# Altium project 高压小功率FOC驱动板.PrjPcb
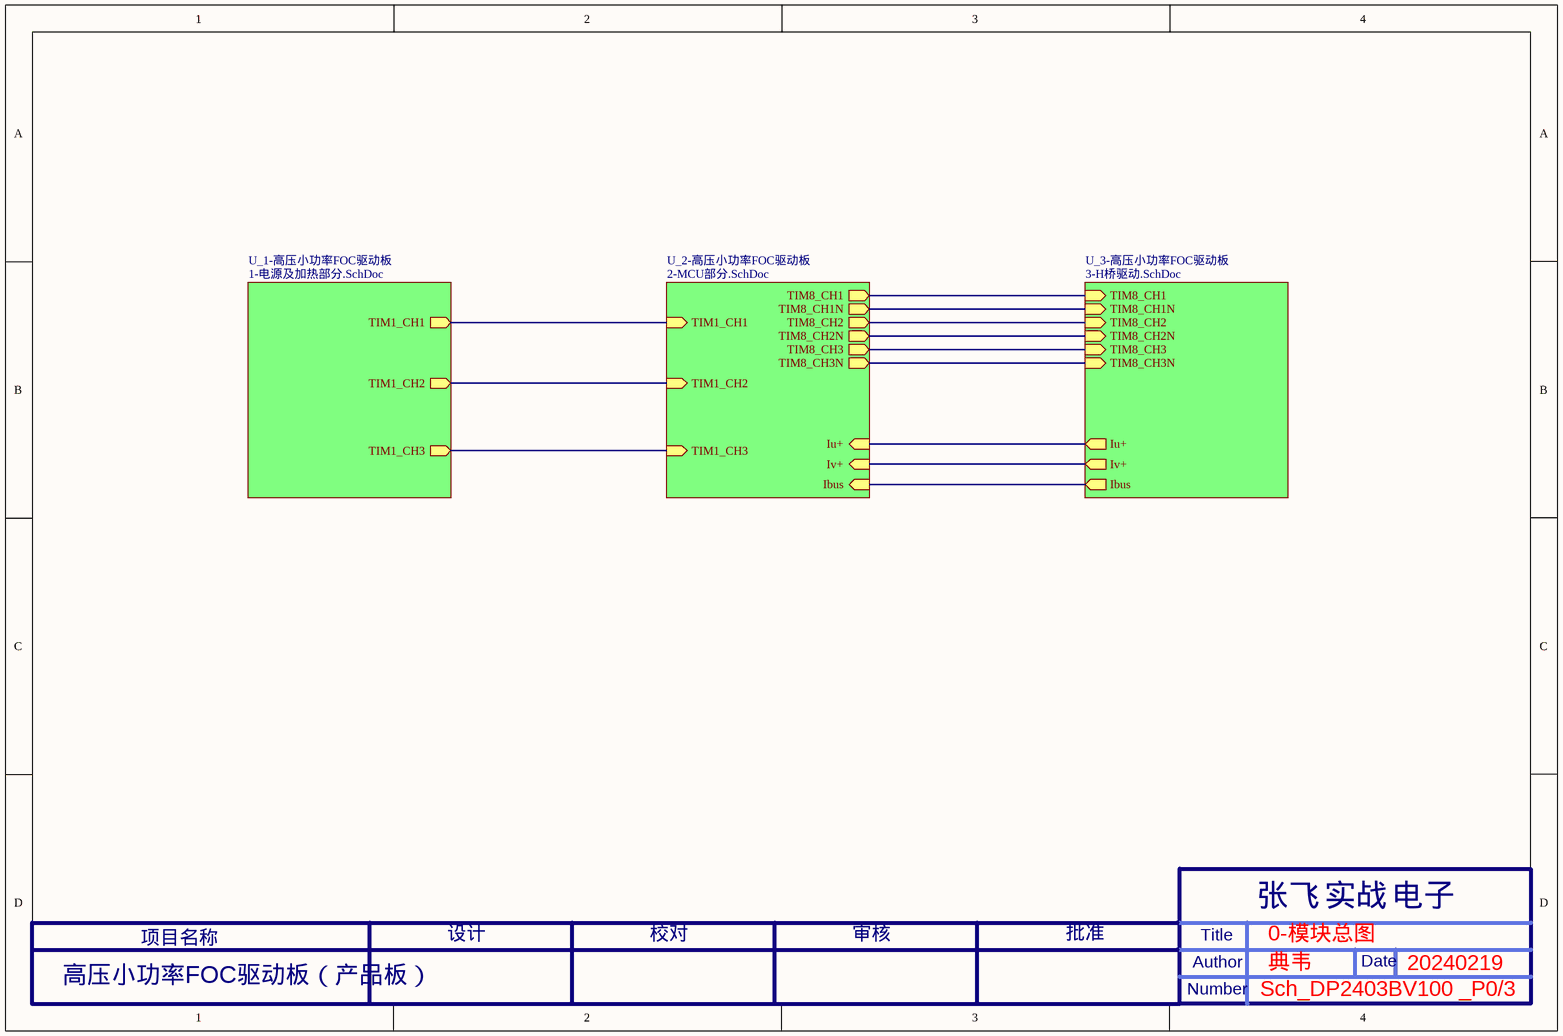
[diagram p0: 0-模块总图.SchDoc]
3 sheets, 103 parts. Net scope: hierarchical (ports join the sheet entries above them; power ports are global).
Board file: 高压小功率FOC驱动板.PcbDoc
Sheets:
  0-模块总图.SchDoc
    U_1-高压小功率FOC驱动板 = 1-电源及加热部分.SchDoc
    U_3-高压小功率FOC驱动板 = 3-H桥驱动.SchDoc

## Sheet 0-模块总图.SchDoc
size A4; SheetNumber: 1; SheetTotal: 4

### Sub-sheets
U_1-高压小功率FOC驱动板 = 1-电源及加热部分.SchDoc: TIM1_CH2 (out), TIM1_CH3 (out), TIM1_CH1 (out)
U_2-高压小功率FOC驱动板 = 2-MCU部分.SchDoc (file not in this document): TIM1_CH2 (in), TIM1_CH3 (in), TIM1_CH1 (in), TIM8_CH1 (out), TIM8_CH1N (out), TIM8_CH2 (out), TIM8_CH2N (out), TIM8_CH3 (out), TIM8_CH3N (out), Ibus (in), Iu+ (in), Iv+ (in)
U_3-高压小功率FOC驱动板 = 3-H桥驱动.SchDoc: TIM8_CH1 (in), TIM8_CH1N (in), TIM8_CH2 (in), TIM8_CH2N (in), TIM8_CH3 (in), TIM8_CH3N (in), Iu+ (out), Iv+ (out), Ibus (out)

### Nets
Ibus: sheet U_2-高压小功率FOC驱动板/Ibus, sheet U_3-高压小功率FOC驱动板/Ibus
TIM1_CH1: sheet U_1-高压小功率FOC驱动板/TIM1_CH1, sheet U_2-高压小功率FOC驱动板/TIM1_CH1
TIM1_CH2: sheet U_1-高压小功率FOC驱动板/TIM1_CH2, sheet U_2-高压小功率FOC驱动板/TIM1_CH2
TIM1_CH3: sheet U_1-高压小功率FOC驱动板/TIM1_CH3, sheet U_2-高压小功率FOC驱动板/TIM1_CH3
TIM8_CH1: sheet U_2-高压小功率FOC驱动板/TIM8_CH1, sheet U_3-高压小功率FOC驱动板/TIM8_CH1
TIM8_CH1N: sheet U_2-高压小功率FOC驱动板/TIM8_CH1N, sheet U_3-高压小功率FOC驱动板/TIM8_CH1N
TIM8_CH2: sheet U_2-高压小功率FOC驱动板/TIM8_CH2, sheet U_3-高压小功率FOC驱动板/TIM8_CH2
TIM8_CH2N: sheet U_2-高压小功率FOC驱动板/TIM8_CH2N, sheet U_3-高压小功率FOC驱动板/TIM8_CH2N
TIM8_CH3: sheet U_2-高压小功率FOC驱动板/TIM8_CH3, sheet U_3-高压小功率FOC驱动板/TIM8_CH3
TIM8_CH3N: sheet U_2-高压小功率FOC驱动板/TIM8_CH3N, sheet U_3-高压小功率FOC驱动板/TIM8_CH3N
NetQ6_S: sheet U_2-高压小功率FOC驱动板/Iu+, sheet U_3-高压小功率FOC驱动板/Iu+
NetQ8_S: sheet U_2-高压小功率FOC驱动板/Iv+, sheet U_3-高压小功率FOC驱动板/Iv+

### Notes on the sheet
- 高压小功率FOC驱动板（产品板）
- 典韦
- 0-模块总图
- 20240219
- Sch_DP2403BV100 _P0/3
- 张飞
- 实战
- 电子
- 项目名称
- 设计
- 校对
- 审核
- 批准
- Author
- Title
- Date
- Number

## Sheet 1-电源及加热部分.SchDoc
size A4; SheetNumber: 2; SheetTotal: 4
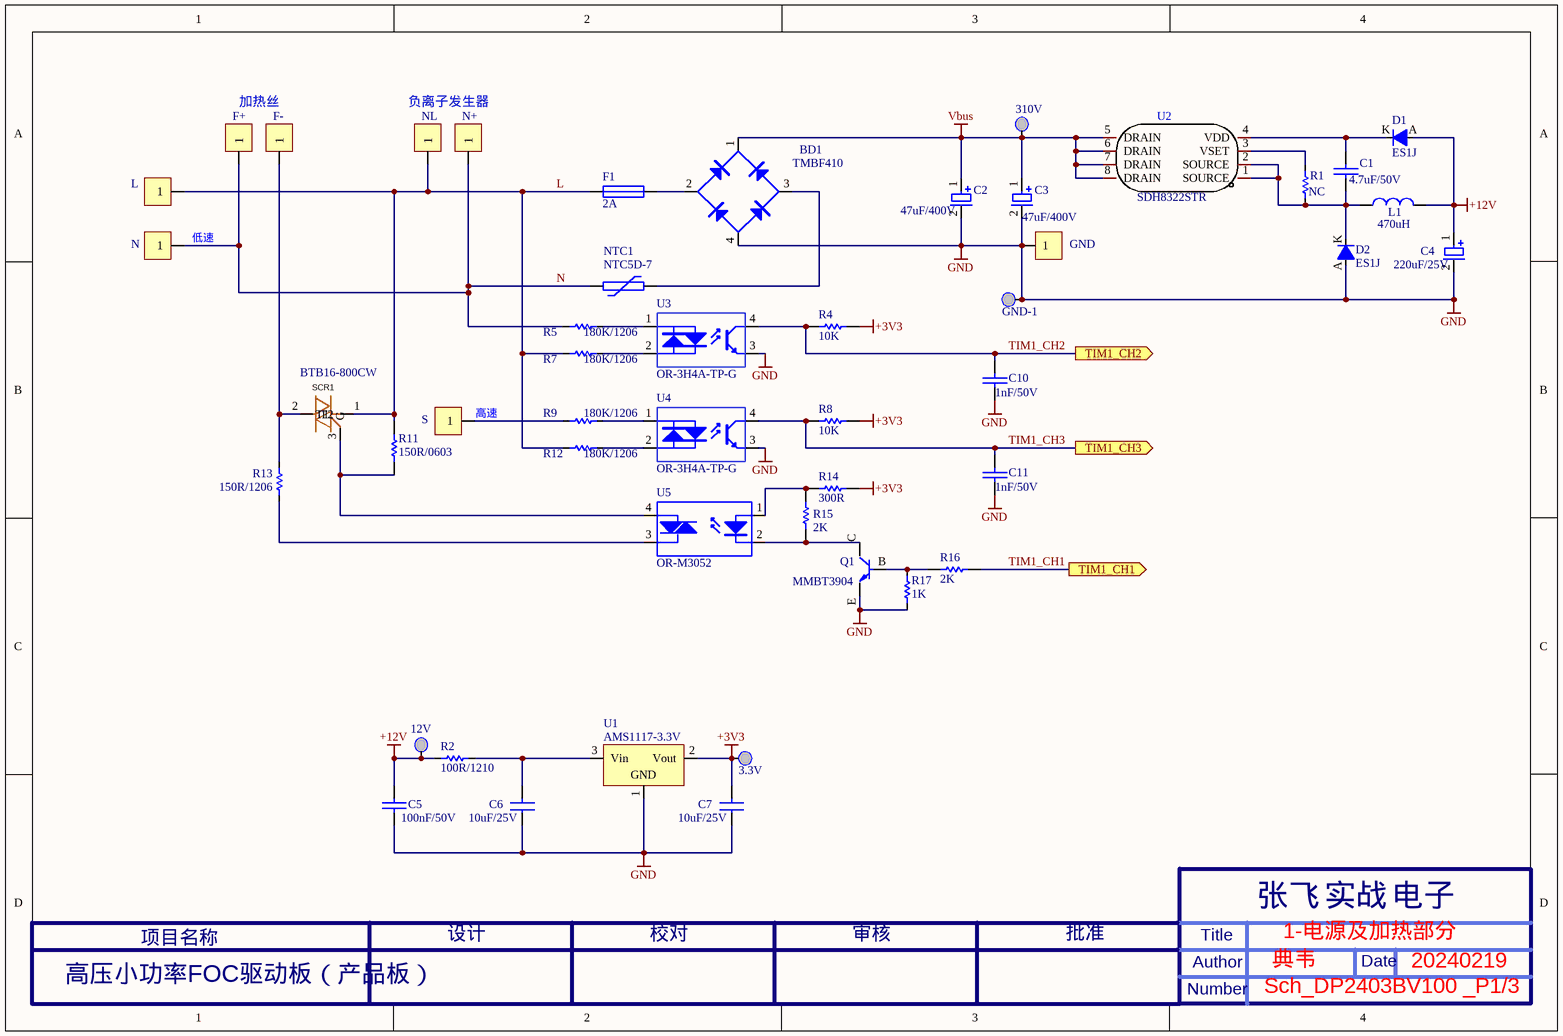
[diagram p1: 1-电源及加热部分.SchDoc]

### Parts
3.3V  test point  [Test_Port]  (value not drawn)  (no BOM)
12V  test point  [Test_Port]  (value not drawn)  (no BOM)
310V  test point  [Test_Port]  (value not drawn)  (no BOM)
BD1  TMBF410  [DBF]
C1  4.7uF/50V  [C0805]
C2  47uF/400V  [D13/L21-5]
C3  47uF/400V  [D13/L21-5]
C4  220uF/25V  [RB3.5/8.2]
C5  100nF/50V  [C0603]
C6  10uF/25V  [C0805]
C7  10uF/25V  [C0805]
C10  1nF/50V  [C0603]
C11  1nF/50V  [C0603]
D1  ES1J  [DO-214AC(SMA)]
D2  ES1J  [DO-214AC(SMA)]
F1  2A  [JFC2410-1200FS]
F+  LT  [IGBT-PIN]  (value not drawn)
F-  T1  [IGBT-PIN]  (value not drawn)
GND  GND  [IGBT-PIN]  (value not drawn)
GND-1  test point  [Test_Port]  (value not drawn)  (no BOM)
L  L  [IGBT-PIN]  (value not drawn)
L1  470uH  [L4.4/7]
N  SL  [IGBT-PIN]  (value not drawn)
N+  NA  [IGBT-PIN]  (value not drawn)
NL  LA  [IGBT-PIN]  (value not drawn)
NTC1  NTC5D-7  [NTC-5D9]
Q1  MMBT3904  [SOT-23-BCE]
R1  NC  [R1206]
R2  100R/1210  [R1210]
R4  10K  [R0603]
R5  180K/1206  [R1206]
R7  180K/1206  [R1206]
R8  10K  [R0603]
R9  180K/1206  [R1206]
R11  150R/0603  [R0603]
R12  180K/1206  [R1206]
R13  150R/1206  [R1206]
R14  300R  [R0603]
R15  2K  [R0603]
R16  2K  [R0603]
R17  1K  [R0603]
S  SH  [IGBT-PIN]  (value not drawn)
SCR1  BTB16-800CW  [TO-263]
U1  AMS1117-3.3V  [SOT-223]
U2  SDH8322STR  [SOIC-8 - duplicate]
U3  OR-3H4A-TP-G  [dip4s]
U4  OR-3H4A-TP-G  [dip4s]
U5  OR-M3052  [SO-4]

### Ports
TIM1_CH1 (out, see 0-模块总图[2B]), TIM1_CH2 (out, see 0-模块总图[2B]), TIM1_CH3 (out, see 0-模块总图[2B])

### Nets
+3V3: 3.3V.1(Test) C7.2 R4.2 R8.1 R14.2 U1.2(Vout)
+12V: 12V.1(Test) C4.1 C5.1 D1.A L1.2 R2.2
GND: BD1.4 C2.2 C3.2 C4.2 C5.2 C6.1 C7.1 C10.2 C11.2 D2.A GND.1 GND-1.1(Test) Q1.E R17.2 U1.1(GND) U3.3(E) U4.3(E)
Vbus: 310V.1(Test) BD1.1 C2.1 C3.1 U2.5(DRAIN) U2.6(DRAIN) U2.7(DRAIN) U2.8(DRAIN)
L: F1.1 L.1 NL.1 R7.1 R11.2 R12.1 SCR1.1(T1)
N: F+.1 N.1 N+.1 NTC1.1 R5.1
TIM1_CH1: R16.2 ; port TIM1_CH1
TIM1_CH2: C10.1 R4.1 U3.4(C) ; port TIM1_CH2
TIM1_CH3: C11.1 R8.2 U4.4(C) ; port TIM1_CH3
NetBD1_2: BD1.2 F1.2
NetBD1_3: BD1.3 NTC1.2
NetC1_1: C1.1 D1.K U2.4(VDD)
NetC1_2: C1.2 D2.K L1.1 R1.1 U2.1(SOURCE) U2.2(SOURCE)
NetC6_2: C6.2 R2.1 U1.3(Vin)
NetF-_1: F-.1 R13.1 SCR1.2(T2)
NetQ1_B: Q1.B R16.1 R17.1
NetQ1_C: Q1.C R15.1 U5.2
NetR1_2: R1.2 U2.3(VSET)
NetR5_2: R5.2 U3.1(A)
NetR7_2: R7.2 U3.2(K)
NetR9_1: R9.1 S.1
NetR9_2: R9.2 U4.1(A)
NetR11_1: R11.1 SCR1.3(G) U5.4
NetR12_2: R12.2 U4.2(K)
NetR13_2: R13.2 U5.3
NetR14_1: R14.1 R15.2 U5.1

### Notes on the sheet
- 加热丝
- 负离子发生器
- (near N) 低速
- (near S) 高速
- 高压小功率FOC驱动板（产品板）
- 典韦
- 1-电源及加热部分
- 20240219
- Sch_DP2403BV100 _P1/3
- 张飞
- 实战
- 电子
- 项目名称
- 设计
- 校对
- 审核
- 批准
- Author
- Title
- Date
- Number

### Library data of the parts
BD1 = BRIDGE1: 贴片整流桥
C1 C5 C10 C11 = CAP: 贴片电容
C2 C3 = CAP_EC: EWH2GM680L300T,D16*L30; Part Number: *; Brand: *
C4 = CAP_EC: 电解电容; Part Number: *; Brand: *
C6 C7 = CAP NP_0: 贴片电容; Manufacturer: TDK; Dielectric: <Dielectric>; Voltage: <Voltage>; RK PN: C1005X5R0J104K050BA; Priority: A; parameter: <parameter>; Manufacturer PN: C1005X5R0J104K050BA; Created by: JJJ
D1 D2 = DIO: 二极管; 品牌: IN4007; Part Number: *; 供应商物料号: *; 规格型号: *
F1 = FUSE1: JFC2410-1200FS
F+ F- GND L N N+ NL S = Pin1: 1Pin
L1 = INDUCTOR: 电感
NTC1 = RES-NTC: 热敏电阻
Q1 = BJT-NPN: 三极管; Part Number: *; Brand: *
R1 R2 R4 R5 R7-R9 R11-R17 = Res: 电阻; Manufacturer: Generic Components; Class: Passive; SubClass: Resistor; Value: 0.125W; Published: 08/06/2000; Publisher: Altium Hobart Technology Centre; Package: 0805
SCR1 = SCR-BT136D: 可控硅; Manufacturer: FUXINSEMI(富芯森美); Name: BT136D; Add into BOM: yes; Symbol: BT136D; Device: BT136D; LCSC Part Name: BT136D-600E; Supplier Part: C842779; Manufacturer Part: BT136D; Supplier Footprint: TO-252AB(TO-252); JLCPCB Part Class: Extended Part; Datasheet: https://atta.szlcsc.com/upload/public/pdf/source/20221031/8E8EBE50990F74DEDCF7AC33B64B1816.pdf; Supplier: LCSC; Convert to PCB: yes
U1 = AMS1117-3.3V: LDO; Published: *; LatestRevisionDate: *; LatestRevisionNote: *; PackageReference: *; Publisher: *; Code_JEDEC: *
U2 = SDH8322STR: Manufacturer: SILAN(士兰微); Add into BOM: yes; Name: SDH8322STR; Symbol: SDH8322STR; Device: SDH8322STR; LCSC Part Name: SDH8322STR; Supplier Part: C601603; Manufacturer Part: SDH8322STR; Supplier Footprint: SOP-8; JLCPCB Part Class: Extended Part; Datasheet: https://atta.szlcsc.com/upload/public/pdf/source/20220114/47A40E3BFCF876A2A0FC3F5058555B84.pdf; Supplier: LCSC; Convert to PCB: yes
U3 U4 = LTV-354T
U5 = ORM305x
3.3V 12V 310V GND-1 = test point: 编号: *; 规格: *

## Sheet 3-H桥驱动.SchDoc
size A4; SheetNumber: 4; SheetTotal: 4
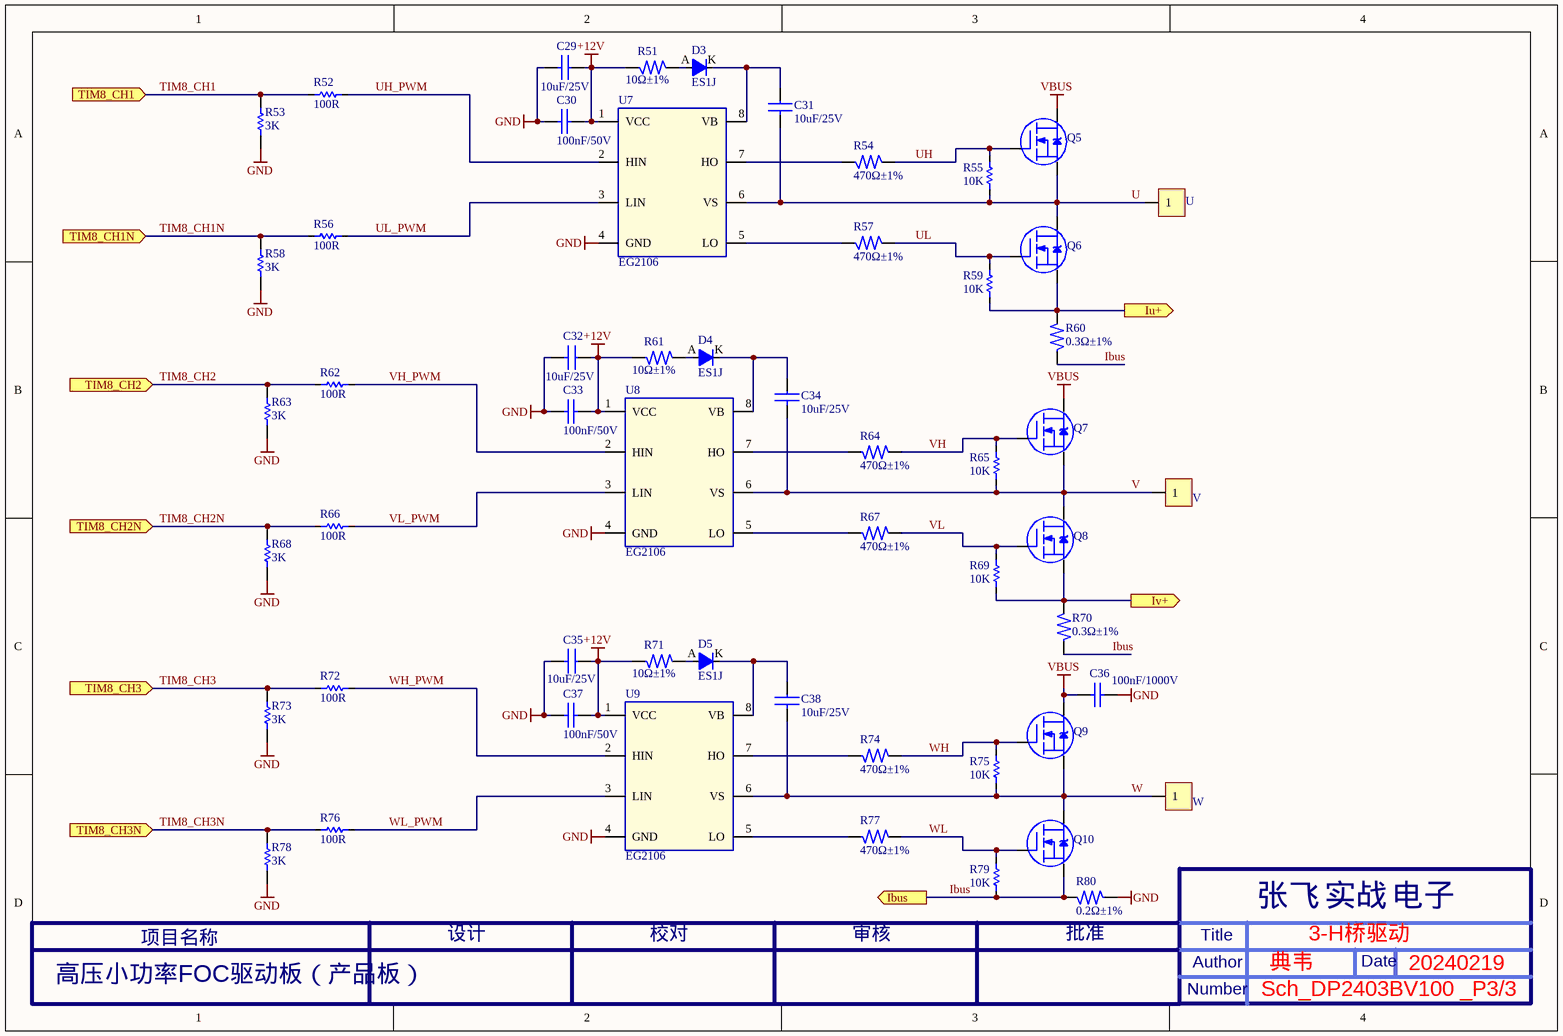
[diagram p2: 3-H桥驱动.SchDoc]

### Parts
C29  10uF/25V  [C0805]
C30  100nF/50V  [C0603]
C31  10uF/25V  [C0805]
C32  10uF/25V  [C0805]
C33  100nF/50V  [C0603]
C34  10uF/25V  [C0805]
C35  10uF/25V  [C0805]
C36  100nF/1000V  [C1812]
C37  100nF/50V  [C0603]
C38  10uF/25V  [C0805]
D3  ES1J  [DO-214AC(SMA)]
D4  ES1J  [DO-214AC(SMA)]
D5  ES1J  [DO-214AC(SMA)]
Q5  MOT5N50D  [TO-252AA]  (value not drawn)
Q6  MOT5N50D  [TO-252AA]  (value not drawn)
Q7  MOT5N50D  [TO-252AA]  (value not drawn)
Q8  MOT5N50D  [TO-252AA]  (value not drawn)
Q9  MOT5N50D  [TO-252AA]  (value not drawn)
Q10  MOT5N50D  [TO-252AA]  (value not drawn)
R51  10Ω±1%  [R0805]
R52  100R  [R0603]
R53  3K  [R0603]
R54  470Ω±1%  [R0603]
R55  10K  [R0603]
R56  100R  [R0603]
R57  470Ω±1%  [R0603]
R58  3K  [R0603]
R59  10K  [R0603]
R60  0.3Ω±1%  [R1206]
R61  10Ω±1%  [R0805]
R62  100R  [R0603]
R63  3K  [R0603]
R64  470Ω±1%  [R0603]
R65  10K  [R0603]
R66  100R  [R0603]
R67  470Ω±1%  [R0603]
R68  3K  [R0603]
R69  10K  [R0603]
R70  0.3Ω±1%  [R1206]
R71  10Ω±1%  [R0805]
R72  100R  [R0603]
R73  3K  [R0603]
R74  470Ω±1%  [R0603]
R75  10K  [R0603]
R76  100R  [R0603]
R77  470Ω±1%  [R0603]
R78  3K  [R0603]
R79  10K  [R0603]
R80  0.2Ω±1%  [R1206]
U  U  [IGBT-PIN]  (value not drawn)
U7  EG2106  [SOIC-8]
U8  EG2106  [SOIC-8]
U9  EG2106  [SOIC-8]
V  V  [IGBT-PIN]  (value not drawn)
W  W  [IGBT-PIN]  (value not drawn)

### Ports
Ibus (out, see 0-模块总图[3B]), Iu+ (out, see 0-模块总图[3B]), Iv+ (out, see 0-模块总图[3B]), TIM8_CH1 (in, see 0-模块总图[3B]), TIM8_CH1N (in, see 0-模块总图[3B]), TIM8_CH2 (in, see 0-模块总图[3B]), TIM8_CH2N (in, see 0-模块总图[3B]), TIM8_CH3 (in, see 0-模块总图[3B]), TIM8_CH3N (in, see 0-模块总图[3B])

### Nets
+12V: C29.1 C30.2 C32.1 C33.2 C35.1 C37.2 R51.1 R61.1 R71.1 U7.1(VCC) U8.1(VCC) U9.1(VCC)
GND: C29.2 C30.1 C32.2 C33.1 C35.2 C36.2 C37.1 R53.2 R58.2 R63.2 R68.2 R73.2 R78.2 R80.1 U7.4(GND) U8.4(GND) U9.4(GND)
Vbus: C36.1 Q5.D Q7.D Q9.D
Ibus: Q10.S R60.1 R70.1 R79.2 R80.2 ; port Ibus
TIM8_CH1: R52.1 R53.1 ; port TIM8_CH1
TIM8_CH1N: R56.1 R58.1 ; port TIM8_CH1N
TIM8_CH2: R62.1 R63.1 ; port TIM8_CH2
TIM8_CH2N: R66.1 R68.1 ; port TIM8_CH2N
TIM8_CH3: R72.1 R73.1 ; port TIM8_CH3
TIM8_CH3N: R76.1 R78.1 ; port TIM8_CH3N
U: C31.2 Q5.S Q6.D R55.2 U.1 U7.6(VS)
UH: Q5.G R54.2 R55.1
UH_PWM: R52.2 U7.2(HIN)
UL: Q6.G R57.2 R59.1
UL_PWM: R56.2 U7.3(LIN)
V: C34.2 Q7.S Q8.D R65.2 U8.6(VS) V.1
VH: Q7.G R64.2 R65.1
VH_PWM: R62.2 U8.2(HIN)
VL: Q8.G R67.2 R69.1
VL_PWM: R66.2 U8.3(LIN)
W: C38.2 Q9.S Q10.D R75.2 U9.6(VS) W.1
WH: Q9.G R74.2 R75.1
WH_PWM: R72.2 U9.2(HIN)
WL: Q10.G R77.2 R79.1
WL_PWM: R76.2 U9.3(LIN)
NetC31_1: C31.1 D3.K U7.8(VB)
NetC34_1: C34.1 D4.K U8.8(VB)
NetC38_1: C38.1 D5.K U9.8(VB)
NetD3_A: D3.A R51.2
NetD4_A: D4.A R61.2
NetD5_A: D5.A R71.2
NetQ6_S: Q6.S R59.2 R60.2 ; port Iu+
NetQ8_S: Q8.S R69.2 R70.2 ; port Iv+
NetR54_1: R54.1 U7.7(HO)
NetR57_1: R57.1 U7.5(LO)
NetR64_1: R64.1 U8.7(HO)
NetR67_1: R67.1 U8.5(LO)
NetR74_1: R74.1 U9.7(HO)
NetR77_1: R77.1 U9.5(LO)

### Notes on the sheet
- 高压小功率FOC驱动板（产品板）
- 典韦
- 3-H桥驱动
- 20240219
- Sch_DP2403BV100 _P3/3
- 张飞
- 实战
- 电子
- 项目名称
- 设计
- 校对
- 审核
- 批准
- Author
- Title
- Date
- Number

### Library data of the parts
C29 C31 C32 C34 C35 C38 = CAP NP_0: as C6 on sheet 1-电源及加热部分; Manufacturer PN: C1005X5R0J104K050BA; Created by: JJJ
C30 C33 C36 C37 = CAP: 贴片电容
D3-D5 = DIO: 二极管; 品牌: IN4007; Part Number: *; 供应商物料号: *; 规格型号: *
R51 R54 R57 R60 R61 R64 R67 R70 R71 R74 R77 R80 = RES: 名称: 贴片电阻
R52 R53 R55 R56 R58 R59 R62 R63 R65 R66 R68 R69 R72 R73 R75 R76 R78 R79 = Res: as R1 on sheet 1-电源及加热部分; Published: 08/06/2000; Publisher: Altium Hobart Technology Centre; Package: 0805
U V W = Pin1: 1Pin
U7-U9 = EG2106: 名称: 贴片IC
Q5-Q10 = MOT5N50D: Supplier-1: IR

## Nets that join several sheets
+12V: 1-电源及加热部分 (6 pins), 3-H桥驱动 (12 pins)
GND: 1-电源及加热部分 (17 pins), 3-H桥驱动 (17 pins)
Vbus: 1-电源及加热部分 (8 pins), 3-H桥驱动 (C36.1 Q5.D Q7.D Q9.D)